# Altium schematic sheet Full_Power_Board.SchDoc
size A
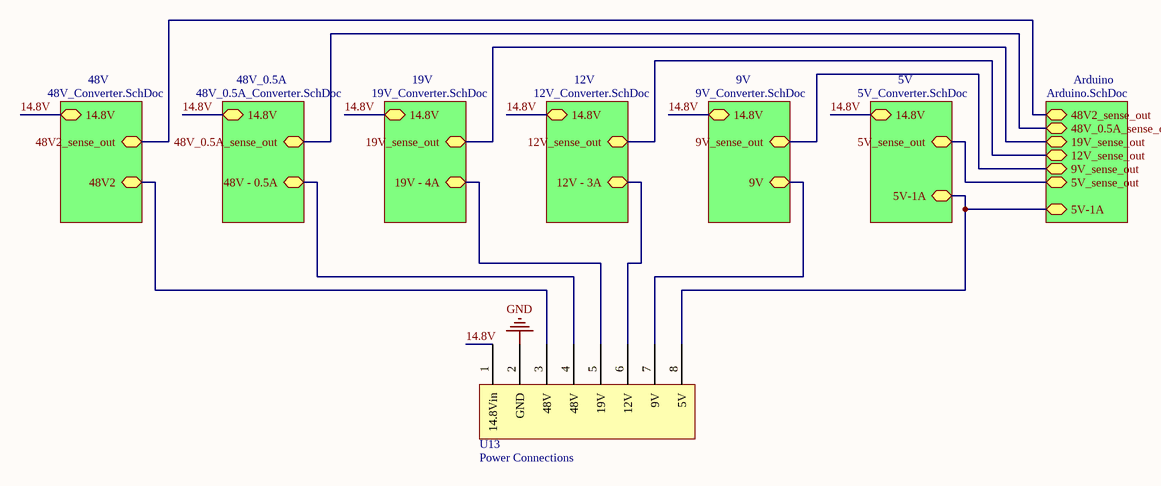
[diagram p0: Full_Power_Board.SchDoc]

## Parts
U13  Power Connections  [Molex Connector]

## Sub-sheets
5V = 5V_Converter.SchDoc: 14.8V, 5V_sense_out, 5V-1A
9V = 9V_Converter.SchDoc: 14.8V, 9V_sense_out, 9V
12V = 12V_Converter.SchDoc: 14.8V, 12V_sense_out, 12V - 3A
19V = 19V_Converter.SchDoc: 14.8V, 19V_sense_out, 19V - 4A
48V = 48V_Converter.SchDoc: 14.8V, 48V2, 48V2_sense_out
48V_0.5A = 48V_0.5A_Converter.SchDoc: 14.8V, 48V - 0.5A, 48V_0.5A_sense_out
Arduino = Arduino.SchDoc: 5V-1A, 5V_sense_out, 9V_sense_out, 12V_sense_out, 19V_sense_out, 48V_0.5A_sense_out, 48V2_sense_out

## Nets
GND: U13.2(GND)
14.8V: U13.1(14.8Vin) ; sheet 48V/14.8V, sheet 48V_0.5A/14.8V, sheet 19V/14.8V, sheet 12V/14.8V, sheet 9V/14.8V, sheet 5V/14.8V
NetU13_3: U13.3(48V) ; sheet 48V/48V2
NetU13_4: U13.4(48V) ; sheet 48V_0.5A/48V - 0.5A
NetU13_5: U13.5(19V) ; sheet 19V/19V - 4A
NetU13_6: U13.6(12V) ; sheet 12V/12V - 3A
NetU13_7: U13.7(9V) ; sheet 9V/9V
NetU13_8: U13.8(5V) ; sheet 5V/5V-1A, sheet Arduino/5V-1A
(unnamed): sheet 48V/48V2_sense_out, sheet Arduino/48V2_sense_out
(unnamed): sheet 48V_0.5A/48V_0.5A_sense_out, sheet Arduino/48V_0.5A_sense_out
(unnamed): sheet 19V/19V_sense_out, sheet Arduino/19V_sense_out
(unnamed): sheet 12V/12V_sense_out, sheet Arduino/12V_sense_out
(unnamed): sheet 9V/9V_sense_out, sheet Arduino/9V_sense_out
(unnamed): sheet 5V/5V_sense_out, sheet Arduino/5V_sense_out

## Library data of the parts
U13 = Molex Connector